# EAGLE design IMUinator2368 (EAGLE 6.2)
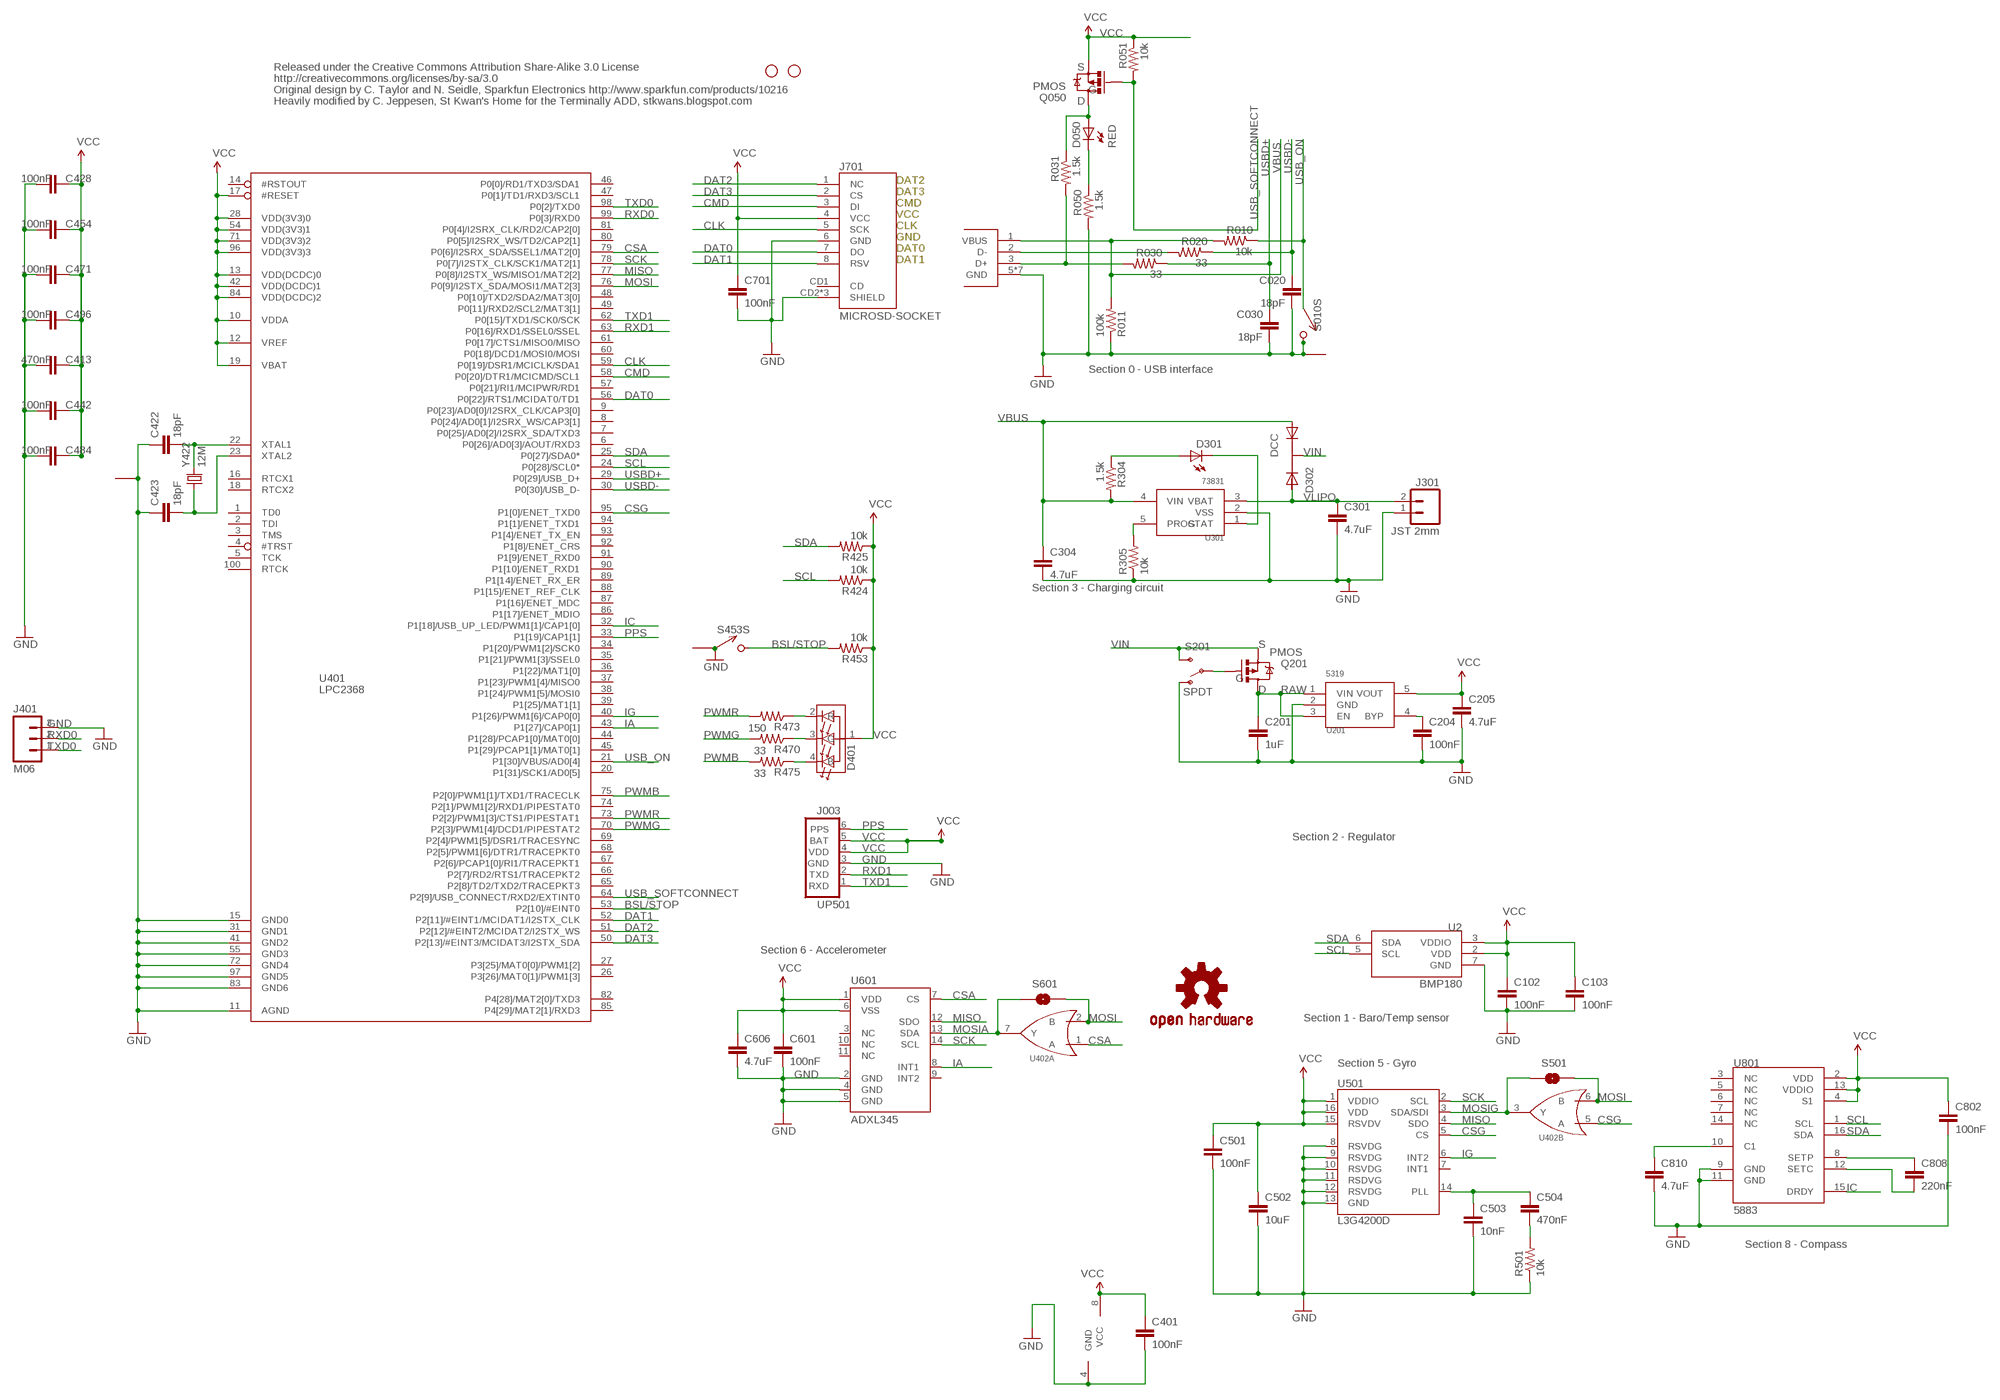
[diagram p0: schematic, sheet 1]

## Parts
C020  18pF  CAP0402-CAP  [0402-CAP]
C030  18pF  CAP0402-CAP  [0402-CAP]
C102  100nF  CAP0402-CAP  [0402-CAP]
C103  100nF  CAP0402-CAP  [0402-CAP]
C201  1uF  CAP0402-CAP  [0402-CAP]
C204  100nF  CAP0402-CAP  [0402-CAP]
C205  4.7uF  CAP0402-CAP  [0402-CAP]
C301  4.7uF  CAP0402-CAP  [0402-CAP]
C304  4.7uF  CAP0402-CAP  [0402-CAP]
C401  100nF  CAP0402-CAP  [0402-CAP]
C413  470nF  CAP0402-CAP  [0402-CAP]
C422  18pF  CAP0402-CAP  [0402-CAP]
C423  18pF  CAP0402-CAP  [0402-CAP]
C428  100nF  CAP0402-CAP  [0402-CAP]
C442  100nF  CAP0402-CAP  [0402-CAP]
C454  100nF  CAP0402-CAP  [0402-CAP]
C471  100nF  CAP0402-CAP  [0402-CAP]
C484  100nF  CAP0402-CAP  [0402-CAP]
C496  100nF  CAP0402-CAP  [0402-CAP]
C501  100nF  CAP0402-CAP  [0402-CAP]
C502  10uF  CAP0603-CAP  [0603-CAP]
C503  10nF  CAP0402-CAP  [0402-CAP]
C504  470nF  CAP0402-CAP  [0402-CAP]
C601  100nF  CAP0402-CAP  [0402-CAP]
C606  4.7uF  CAP0402-CAP  [0402-CAP]
C701  100nF  CAP0402-CAP  [0402-CAP]
C802  100nF  CAP0402-CAP  [0402-CAP]
C808  220nF  CAP0402-CAP  [0402-CAP]
C810  4.7uF  CAP0402-CAP  [0402-CAP]
D050  RED  LED0603  [LED-0603]
D301  RED  LED0603  [LED-0603]
D302  DCC  PMEG2005CT  [SOT-23-3]
D401  RGB  HSMF-C118  [HSMF-C118]
J001  USB_MICROB_JST  [UB-MC5BR3-SD204-4S]
J003  UP501  [UP501]
J301  JST 2mm  M02-JST-2MM-SMT  [JST-2-SMD]
J401  M06  M03PTH  [1X03]
J701  MICROSD-SOCKET  [MICROSD-SOCKET-PP]
JP1  STAND-OFF  [STAND-OFF]
JP2  STAND-OFF  [STAND-OFF]
Q050  PMOS  MOSFET-PCHANNELSMD  [SOT23-3]
Q201  PMOS  MOSFET-PCHANNELSMD  [SOT23-3]
R010  10k  RESISTOR0402-RES  [0402-RES]
R011  100k  RESISTOR0402-RES  [0402-RES]
R020  33  RESISTOR0402-RES  [0402-RES]
R030  33  RESISTOR0402-RES  [0402-RES]
R031  1.5k  RESISTOR0402-RES  [0402-RES]
R050  1.5k  RESISTOR0402-RES  [0402-RES]
R051  10k  RESISTOR0402-RES  [0402-RES]
R304  1.5k  RESISTOR0402-RES  [0402-RES]
R305  10k  RESISTOR0402-RES  [0402-RES]
R424  10k  RESISTOR0402-RES  [0402-RES]
R425  10k  RESISTOR0402-RES  [0402-RES]
R453  10k  RESISTOR0402-RES  [0402-RES]
R470  33  RESISTOR0402-RES  [0402-RES]
R473  150  RESISTOR0402-RES  [0402-RES]
R475  33  RESISTOR0402-RES  [0402-RES]
R501  10k  RESISTOR0402-RES  [0402-RES]
S010  SPST  B3U-1100P  [B3U-1100P]
S201  SPDT  SWITCH-SPSTSMD  [AYZ0202]
S453  SPST  B3U-1100P  [B3U-1100P]
S501  SOLDERJUMPERNO  [SJ_2S-NO]
S601  SOLDERJUMPERNO  [SJ_2S-NO]
U2  BMP180  [BMP180]
U201  5319  MIC5319D5  [SOT-23-5]
U301  73831  MCP73831  [SOT-23-5]
U401  LPC2368  [LQFP100]
U402  7432  SN74LVC2G32  [DCU_8]
U501  L3G4200D  [LGA16-4X4]
U601  ADXL345  [LGA14]
U801  5883  HMC5883LSMD  [16LPCC]
U$3  OSHW-LOGOS  [OSHW-LOGO-S]
Y422  12M  TSX-3225  [CRYSTAL_SMD]

## Nets
BSL/STOP: R453.2 S453.P$2 U401.53(P2[10]/#EINT0)
CLK: J701.5(SCK) U401.59(P0[19]/DSR1/MCICLK/SDA1)
CMD: J701.3(DI) U401.58(P0[20]/DTR1/MCICMD/SCL1)
CONN_D+: J001.3(D+) R030.2 R031.2
CONN_D-: J001.2(D-) R020.2
CSA: U401.79(P0[6]/I2SRX_SDA/SSEL1/MAT2[0]) U402.1(A:A) U601.7(CS)
CSG: U401.95(P1[0]/ENET_TXD0) U402.5(B:A) U501.5(CS)
DAT0: J701.7(DO) U401.56(P0[22]/RTS1/MCIDAT0/TD1)
DAT1: J701.8(RSV) U401.52(P2[11]/#EINT1/MCIDAT1/I2STX_CLK)
DAT2: J701.1(NC) U401.51(P2[12]/#EINT2/MCIDAT2/I2STX_WS)
DAT3: J701.2(CS) U401.50(P2[13]/#EINT3/MCIDAT3/I2STX_SDA)
DB: D401.4(B) R475.1
DG: D401.2(R) R473.1
DR: D401.3(G) R470.1
GND: C020.2 C030.2 C102.2 C103.2 C201.2 C204.2 C205.2 C301.2 C304.2 C401.2 C413.2 C422.1 C423.1 C428.2 C442.2 C454.2 C471.2 C484.2 C496.2 C501.2 C502.2 C503.2 C601.2 C606.2 C701.2 C802.2 C810.2 J001.5(GND) J001.P$6(GND) J001.P$7(GND) J001.P$8(GND) J001.P$9(GND) J001.P$10(GND) J001.P$11(GND) J003.3(GND) J301.1 J401.3 J701.6(GND) J701.CD2(SHIELD) J701.GND1(SHIELD) J701.GND3(SHIELD) R011.1 R050.2 R305.1 R501.1 S010.P$2 S010.P$3 S201.1(O) S453.P$1 S453.P$3 U2.7(GND) U201.2(GND) U301.2(VSS) U401.11(AGND) U401.15(GND0) U401.31(GND1) U401.41(GND2) U401.55(GND3) U401.72(GND4) U401.83(GND6) U401.97(GND5) U402.4(PWR:GND) U501.8(RSVDG) U501.9(RSVDG) U501.10(RSVDG) U501.11(RSDVG) U501.12(RSVDG) U501.13(GND) U601.2(GND) U601.4(GND) U601.5(GND) U801.9(GND) U801.11(GND) Y422.2 Y422.4
IA: U401.43(P1[27]/CAP0[1]) U601.8(INT1)
IC: U401.32(P1[18]/USB_UP_LED/PWM1[1]/CAP1[0]) U801.15(DRDY)
IG: U401.40(P1[26]/PWM1[6]/CAP0[0]) U501.6(INT2)
MISO: U401.77(P0[8]/I2STX_WS/MISO1/MAT2[2]) U501.4(SDO) U601.12(SDO)
MOSI: S501.2 S601.2 U401.76(P0[9]/I2STX_SDA/MOSI1/MAT2[3]) U402.2(A:B) U402.6(B:B)
MOSIA: S601.1 U402.7(A:Y) U601.13(SDA)
MOSIG: S501.1 U402.3(B:Y) U501.3(SDA/SDI)
N$1: D301.A R304.1
N$4: C503.1 C504.1 U501.14(PLL)
N$5: C504.2 R501.2
N$6: D050.A Q050.3(D) R031.1
N$7: D050.C R050.1
N$14: C808.1 U801.8(SETP)
N$15: C808.2 U801.12(SETC)
N$16: C810.1 U801.10(C1)
N$17: C204.1 U201.4(BYP)
PPS: J003.6(PPS) U401.33(P1[19]/CAP1[1])
PWMB: R475.2 U401.75(P2[0]/PWM1[1]/TXD1/TRACECLK)
PWMG: R470.2 U401.70(P2[3]/PWM1[4]/DCD1/PIPESTAT2)
PWMR: R473.2 U401.73(P2[2]/PWM1[3]/CTS1/PIPESTAT1)
PWR_SWITCH: Q201.1(G) S201.2(P)
RAW: C201.1 Q201.3(D) U201.1(VIN) U201.3(EN)
REG_PROG: R305.2 U301.5(PROG)
REG_STAT: D301.C U301.1(STAT)
RXD0: J401.2 U401.99(P0[3]/RXD0)
RXD1: J003.2(TXD) U401.63(P0[16]/RXD1/SSEL0/SSEL)
SCK: U401.78(P0[7]/I2STX_CLK/SCK1/MAT2[1]) U501.2(SCL) U601.14(SCL)
SCL: R424.2 U2.5(SCL) U401.24(P0[28]/SCL0*) U801.1(SCL)
SDA: R425.2 U2.6(SDA) U401.25(P0[27]/SDA0*) U801.16(SDA)
TXD0: J401.1 U401.98(P0[2]/TXD0)
TXD1: J003.1(RXD) U401.62(P0[15]/TXD1/SCK0/SCK)
USB_ON: R010.1 S010.P$1 U401.21(P1[30]/VBUS/AD0[4])
USB_SOFTCONNECT: Q050.1(G) R051.2 U401.64(P2[9]/USB_CONNECT/RXD2/EXTINT0)
USBD+: C030.1 R030.1 U401.29(P0[29]/USB_D+)
USBD-: C020.1 R020.1 U401.30(P0[30]/USB_D-)
VBUS [power]: C304.1 D302.1(A1) J001.1(VBUS) R010.2 R011.2 R304.2 U301.4(VIN)
VCC: C102.1 C103.1 C205.1 C401.1 C413.1 C428.1 C442.1 C454.1 C471.1 C484.1 C496.1 C501.1 C502.1 C601.1 C606.1 C701.1 C802.1 D401.1(A) J003.4(VDD) J003.5(BAT) J701.4(VCC) Q050.2(S) R051.1 R424.1 R425.1 R453.1 U2.2(VDD) U2.3(VDDIO) U201.5(VOUT) U401.10(VDDA) U401.12(VREF) U401.13(VDD(DCDC)0) U401.17(#RESET) U401.19(VBAT) U401.28(VDD(3V3)0) U401.42(VDD(DCDC)1) U401.54(VDD(3V3)1) U401.71(VDD(3V3)2) U401.84(VDD(DCDC)2) U401.96(VDD(3V3)3) U402.8(PWR:VCC) U501.1(VDDIO) U501.15(RSVDV) U501.16(VDD) U601.1(VDD) U601.6(VSS) U801.2(VDD) U801.4(S1) U801.13(VDDIO)
VIN: D302.3(K) Q201.2(S) S201.3(S)
VLIPO [power]: C301.1 D302.2(A2) J301.2 U301.3(VBAT)
XTAL1: C422.2 U401.22(XTAL1) Y422.3
XTAL2: C423.2 U401.23(XTAL2) Y422.1
Unconnected: J701.CD1(CD) U401.1(TD0) U401.2(TDI) U401.3(TMS) U401.4(#TRST) U401.5(TCK) U401.6(P0[26]/AD0[3]/AOUT/RXD3) U401.7(P0[25]/AD0[2]/I2SRX_SDA/TXD3) U401.8(P0[24]/AD0[1]/I2SRX_WS/CAP3[1]) U401.9(P0[23]/AD0[0]/I2SRX_CLK/CAP3[0]) U401.14(#RSTOUT) U401.16(RTCX1) U401.18(RTCX2) U401.20(P1[31]/SCK1/AD0[5]) U401.26(P3[26]/MAT0[1]/PWM1[3]) U401.27(P3[25]/MAT0[0]/PWM1[2]) U401.34(P1[20]/PWM1[2]/SCK0) U401.35(P1[21]/PWM1[3]/SSEL0) U401.36(P1[22]/MAT1[0]) U401.37(P1[23]/PWM1[4]/MISO0) U401.38(P1[24]/PWM1[5]/MOSI0) U401.39(P1[25]/MAT1[1]) U401.44(P1[28]/PCAP1[0]/MAT0[0]) U401.45(P1[29]/PCAP1[1]/MAT0[1]) U401.46(P0[0]/RD1/TXD3/SDA1) U401.47(P0[1]/TD1/RXD3/SCL1) U401.48(P0[10]/TXD2/SDA2/MAT3[0]) U401.49(P0[11]/RXD2/SCL2/MAT3[1]) U401.57(P0[21]/RI1/MCIPWR/RD1) U401.60(P0[18]/DCD1/MOSI0/MOSI) U401.61(P0[17]/CTS1/MISO0/MISO) U401.65(P2[8]/TD2/TXD2/TRACEPKT3) U401.66(P2[7]/RD2/RTS1/TRACEPKT2) U401.67(P2[6]/PCAP1[0]/RI1/TRACEPKT1) U401.68(P2[5]/PWM1[6]/DTR1/TRACEPKT0) U401.69(P2[4]/PWM1[5]/DSR1/TRACESYNC) U401.74(P2[1]/PWM1[2]/RXD1/PIPESTAT0) U401.80(P0[5]/I2SRX_WS/TD2/CAP2[1]) U401.81(P0[4]/I2SRX_CLK/RD2/CAP2[0]) U401.82(P4[28]/MAT2[0]/TXD3) U401.85(P4[29]/MAT2[1]/RXD3) U401.86(P1[17]/ENET_MDIO) U401.87(P1[16]/ENET_MDC) U401.88(P1[15]/ENET_REF_CLK) U401.89(P1[14]/ENET_RX_ER) U401.90(P1[10]/ENET_RXD1) U401.91(P1[9]/ENET_RXD0) U401.92(P1[8]/ENET_CRS) U401.93(P1[4]/ENET_TX_EN) U401.94(P1[1]/ENET_TXD1) U401.100(RTCK) U501.7(INT1) U601.3(NC) U601.9(INT2) U601.10(NC) U601.11(NC) U801.3(NC) U801.5(NC) U801.6(NC) U801.7(NC) U801.14(NC)

## Notes on the sheet
- Released under the Creative Commons Attribution Share-Alike 3.0 License | S
- http://creativecommons.org/licenses/by-sa/3.0
- Original design by C. Taylor and N. Seidle, Sparkfun Electronics http://www.sparkfun.com/products/10216 | G
- Heavily modified by C. Jeppesen, St Kwan's Home for the Terminally ADD, stkwans.blogspot.com | D
- DAT2
- DAT3
- CMD
- VCC
- CLK
- GND
- DAT0
- DAT1
- Section 0 - USB interface
- Section 3 - Charging circuit
- S
- G
- D
- Section 2 - Regulator
- Section 6 - Accelerometer
- Section 1 - Baro/Temp sensor
- Section 5 - Gyro
- Section 8 - Compass

## Library data of the parts
C020 C030 C422 C423 = SparkFun:CAP: Capacitor Standard 0603 ceramic capacitor, and 0.1" leaded capacitor.; DIGIKEY: 445-1238-1-ND
C102 C103 C204 C401 C428 C442 C454 C471 C484 C496 C501 C601 C701 C802 = SparkFun:CAP: Capacitor Standard 0603 ceramic capacitor, and 0.1" leaded capacitor.; DIGIKEY: 445-1268-1-ND
C201 = SparkFun:CAP: Capacitor Standard 0603 ceramic capacitor, and 0.1" leaded capacitor.; DIGIKEY: 445-1415-1-ND
C205 C301 C304 C606 C810 = SparkFun:CAP: Capacitor Standard 0603 ceramic capacitor, and 0.1" leaded capacitor.; DIGIKEY: 445-7395-1-ND
C413 C504 = SparkFun:CAP: Capacitor Standard 0603 ceramic capacitor, and 0.1" leaded capacitor.; DIGIKEY: 445-4976-1-ND
C502 = SparkFun-Passives:CAP: Capacitor Standard 0603 ceramic capacitor, and 0.1" leaded capacitor.; DIGIKEY: 445-7486-1-ND
C503 = SparkFun:CAP: Capacitor Standard 0603 ceramic capacitor, and 0.1" leaded capacitor.; DIGIKEY: 445-4943-1-ND
C808 = SparkFun:CAP: Capacitor Standard 0603 ceramic capacitor, and 0.1" leaded capacitor.; DIGIKEY: 445-4972-1-ND
D050 D301 = SparkFun:LED: LEDs Standard schematic elements and footprints for 5mm, 3mm, 1206, and 0603 sized LEDs. 5mm - Spark Fun Electronics SKU : COM-00529 (and others); DIGIKEY: 350-2029-1-ND
D302 = KwanSystems:PMEG2005CT; DIGIKEY: 568-6500-1-ND
D401 = KwanSystems:HSMF-C118; DIGIKEY: 516-1778-1-ND
J001 = KwanSystems:USB_MICROB_JST; DIGIKEY: 455-2562-1-ND
J003 = KwanSystems:UP501; DIGIKEY: $NOPART
J301 = SparkFun:M02: Header 2 Standard 2-pin 0.1" header. Use with straight break away headers (SKU : PRT-00116), right angle break away headers (PRT-00553), swiss pins (PRT-00743), machine pins (PRT-00117), and female headers (PRT-00115). Molex polarized connector foot print use with SKU : PRT-08233 with associated crimp pins and housings.; DIGIKEY: 455-1749-1-ND
J401 = SparkFun-Connectors:M03: Header 3 Standard 3-pin 0.1" header. Use with straight break away headers (SKU : PRT-00116), right angle break away headers (PRT-00553), swiss pins (PRT-00743), machine pins (PRT-00117), and female headers (PRT-00115). Molex polarized connector foot print use with SKU : PRT-08232 with associated crimp pins and housings.; DIGIKEY: $NOPART
J701 = KwanSystems:MICROSD-SOCKET: microSD Socket Push-push type uSD socket. Digikey 101-00660-68-6-1-ND. tDoc lines correctly indicate media card edge positions when inserting (unlocked, locked, depressed).; DIGIKEY: 101-00581-59-1-ND
JP1 JP2 = SparkFun:STAND-OFF: Stand Off This is the mechanical footprint for a #4 phillips button head screw. Use the keepout ring to avoid running the screw head into surrounding components. SKU : PRT-00447; DIGIKEY: $NOPART
Q050 Q201 = SparkFun:MOSFET-PCHANNEL; DIGIKEY: NTR1P02T1GOSCT-ND
R010 R051 R305 = SparkFun:RESISTOR: Resistor Basic schematic elements and footprints for 0603, 1206, and PTH resistors.; DIGIKEY: P10.0KLCT-ND
R011 = SparkFun:RESISTOR: Resistor Basic schematic elements and footprints for 0603, 1206, and PTH resistors.; DIGIKEY: P100KLCT-ND
R020 R030 R473 R475 = SparkFun:RESISTOR: Resistor Basic schematic elements and footprints for 0603, 1206, and PTH resistors.; DIGIKEY: P33.0LCT-ND
R031 R050 R304 = SparkFun:RESISTOR: Resistor Basic schematic elements and footprints for 0603, 1206, and PTH resistors.; DIGIKEY: P1.50KLCT-ND
R424 R425 R453 R501 = SparkFun-Passives:RESISTOR: Resistor Basic schematic elements and footprints for 0603, 1206, and PTH resistors.; DIGIKEY: P10.0KLCT-ND
R470 = SparkFun:RESISTOR: Resistor Basic schematic elements and footprints for 0603, 1206, and PTH resistors.; DIGIKEY: P150LCT-ND
S010 S453 = KwanSystems:B3U-1100P; DIGIKEY: SW1021CT-ND
S201 = SparkFun:SWITCH-SPST: SPST Switch Simple slide switch. Spark Fun Electronics SKU : COM-00102; DIGIKEY: 401-2013-1-ND
S501 S601 = SparkFun:SOLDERJUMPER: Solder Jumper Standard SMD solder jumper. Used to automate production. Two varients : Normally Open and Normally Closed are the same, but have different paste layers. NC will have a large amount of paste and should jumper during reflow.; DIGIKEY: $NOPART
U2 = KwanSystems:BMP180; DIGIKEY: 828-1027-1-ND
U201 = KwanSystems:MIC5319; DIGIKEY: 576-1910-1-ND
U301 = KwanSystems:MCP73831; DIGIKEY: MCP73831T-2ACI/OTCT-ND
U401 = KwanSystems:LPC2368; DIGIKEY: 568-3997-ND
U402 = KwanSystems:SN74LVC2G32; DIGIKEY: 296-13268-1-ND
U501 = SparkFun:L3G4200D: L3G4200D Three-axis, digital output gyroscope The L3G4200D is a low-power three-axis angular rate sensor, has a full scale of ±250/±500/±2000 dps and is capable of measuring rates with a user-selectable bandwidth. It includes a sensing element and an IC interface capable of providing the measured angular rate to the external world through a digital interface (I2C/SPI). Package: 4x4x1.1 LGA-16 (LGA16-4x4.PAC); DIGIKEY: 497-11071-1-ND
U601 = SparkFun:ADXL345; DIGIKEY: ADXL345BCCZ-RL7CT-ND
U801 = SparkFun:HMC5883L: 3 Axis Digital Compass IC; DIGIKEY: 342-1082-1-ND
U$3 = SparkFun:OSHW-LOGO: Open Source Hardware Logo This logo indicates the piece of hardware it is found on incorporates a OSHW license and/or adheres to the definition of open source hardware found here: http://freedomdefined.org/OSHW; DIGIKEY: $NOPART
Y422 = KwanSystems:TSX-3225; DIGIKEY: 887-1316-1-ND

## Net classes
0 default: width 0.152 mm, drill 0.33 mm, clearance 0.152 mm
1 power: width 0.152 mm, drill 0.33 mm, clearance 0.152 mm to class 0, clearance 0.152 mm
2 hv: width 0.152 mm, drill 0.33 mm, clearance 0.152 mm to class 0, clearance 0.152 mm to class 1, clearance 0.152 mm

## Board
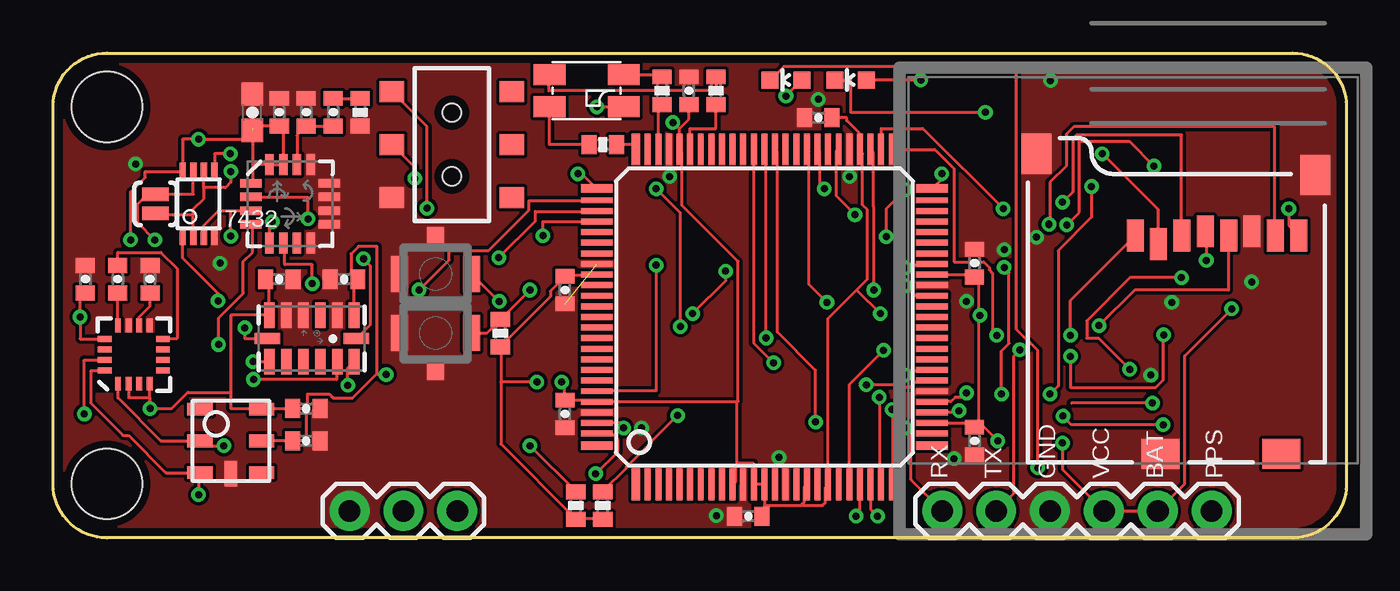
[diagram p1: board, top side]
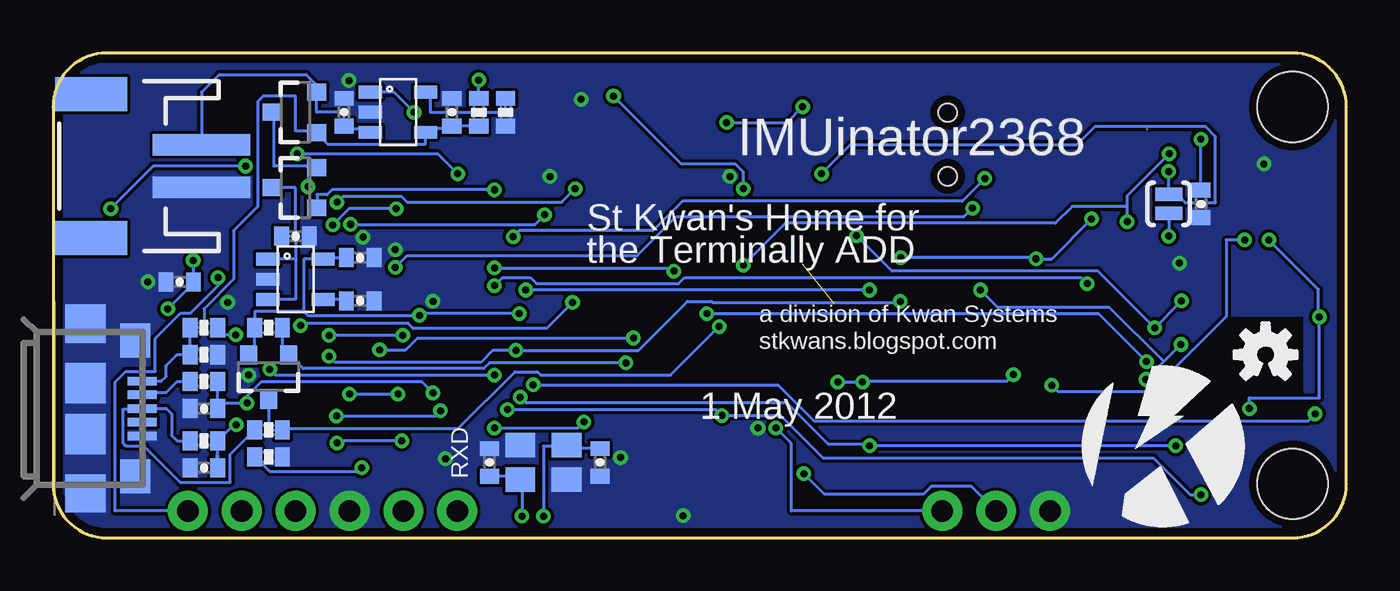
[diagram p2: board, bottom side, seen from below]

Size 60.96 x 22.86 mm. Coordinates in mm from the lower left corner, seen from the top.
Outline: 2.54,22.86 58.42,22.86 arc-90 60.96,20.32 60.96,2.54 arc-90 58.42,0 2.54,0 arc-90 0,2.54 0,20.32 arc-90 2.54,22.86
Copper layers (1*16): Top 0.0356mm / dielectric 1.5011mm / Bottom 0.0356mm
Design rules: minimum track width 6mil, minimum drill 13mil, track to track 6mil, track to pad 6mil, pad to pad 6mil, via to via 6mil, smd to smd 6mil, copper to edge 15mil, drill to drill 6mil, minimum pad ring 7mil, minimum via ring 7mil, stop-mask expansion 4mil, vias tented up to drill 14mil, thermal gap 10mil
tRestrict: area 2,9.7 to 2.8,10.4; area 4.8,9.7 to 5.6,10.4; area 2.8,7.6 to 4.8,9.7; area 4.8,6.9 to 5.6,7.6; area 2,6.9 to 2.8,7.6
bRestrict: area 2,6.9 to 5.6,10.4

### Footprints (pad centres in the part's own frame; a part is rotated, then mirrored left to right if it is on the bottom)
0402-CAP = smd 0.7 x 0.9: 1 -0.65,0; 2 0.65,0
0603-CAP = smd 1.1 x 1: 1 -0.85,0; 2 0.85,0
LED-0603 = smd 0.8 x 0.8: A 0,-0.75; C 0,0.75
SOT-23-3 = smd 0.9 x 0.8: 1 -1,0.95; 2 -1,-0.95; 3 1.1,0
HSMF-C118 = smd 1.5 x 1: 1 1.75,-0.75; 2 1.75,0.75; 3 -1.75,0.75; 4 -1.75,-0.75
UB-MC5BR3-SD204-4S = smd 0.4 x 1.35: 1 -1.3,2.675; 2 -0.65,2.675; 3 0,2.675; 4 0.65,2.675; 5 1.3,2.675 | smd 1.8 x 1.9: P$6 4,0; P$7 -4,0 | smd 1.9 x 1.9: P$8 -1.2,0; P$9 1.2,0 | smd 1.6 x 1.4: P$10 -3.2,2.35; P$11 3.2,2.35
UP501 = drill 1.016 pad 1.88: 1 0,0; 2 2.54,0; 3 5.08,0; 4 7.62,0; 5 10.16,0; 6 12.7,0
JST-2-SMD = smd 1 x 4.6: 1 -1,-3.7; 2 1,-3.7 | smd 1.6 x 3.4: NC1 -3.4,1.5; NC2 3.4,1.5
1X03 = drill 1.016 pad 1.88: 1 0,0; 2 2.54,0; 3 5.08,0
MICROSD-SOCKET-PP = smd 0.8 x 1.5: 1 -8.94,10.7; 2 -7.84,10.3; 3 -6.74,10.7; 4 -5.64,10.9; 5 -4.54,10.7; 6 -3.44,10.9; 7 -2.34,10.7; 8 -1.24,10.7 | smd 1.8 x 1.4: CD1 -2.05,0.4; CD2 -7.75,0.4 | smd 1.4 x 1.9: GND1 -13.6,14.55; GND3 -0.45,13.55
STAND-OFF = hole 3.302: 0,0
SOT23-3 = smd 0.8 x 0.9: 1 -0.95,-1; 2 0.95,-1; 3 0,1.1
0402-RES = smd 0.7 x 0.9: 1 -0.65,0; 2 0.65,0
B3U-1100P = smd 0.8 x 1.7: P$1 -1.7,0; P$2 1.7,0 | smd 0.8 x 1.1: P$3 0,-1.65
AYZ0202 = smd 1 x 1.15: 1 -2.5,2.825; 2 0,2.825; 3 2.5,2.825; 4 -2.5,-2.825; 5 0,-2.825; 6 2.5,-2.825 | hole 0.85: 1.5,0; -1.5,0
SJ_2S-NO = smd 0.635 x 1.27: 1 -0.45,0; 2 0.45,0
BMP180 = smd 0.6 x 1.2: 1 1.5,1.45; 2 0,1.45; 3 -1.5,1.45; 4 -1.5,-1.45; 5 0,-1.45; 6 1.5,-1.45 | smd 1.2 x 0.6: 7 1.55,0
SOT-23-5 = smd 0.6 x 1.1: 1 -0.95,-1.3; 2 0,-1.3; 3 0.95,-1.3; 4 0.95,1.3; 5 -0.95,1.3
LQFP100 = smd 1.5 x 0.4: 1 -7.9,6.06; 25 -7.9,-6.06; 51 7.9,-6.06; 75 7.9,6.06 | smd 1.5 x 0.28: 2 -7.9,5.5; 3 -7.9,5; 4 -7.9,4.5; 5 -7.9,4; 6 -7.9,3.5; 7 -7.9,3; 8 -7.9,2.5; 9 -7.9,2; 10 -7.9,1.5; 11 -7.9,1; 12 -7.9,0.5; 13 -7.9,0; 14 -7.9,-0.5; 15 -7.9,-1; 16 -7.9,-1.5; 17 -7.9,-2; 18 -7.9,-2.5; 19 -7.9,-3; 20 -7.9,-3.5; 21 -7.9,-4; 22 -7.9,-4.5; 23 -7.9,-5; 24 -7.9,-5.5; 52 7.9,-5.5; 53 7.9,-5; 54 7.9,-4.5; 55 7.9,-4; 56 7.9,-3.5; 57 7.9,-3; 58 7.9,-2.5; 59 7.9,-2; 60 7.9,-1.5; 61 7.9,-1; 62 7.9,-0.5; 63 7.9,0; 64 7.9,0.5; 65 7.9,1; 66 7.9,1.5; 67 7.9,2; 68 7.9,2.5; 69 7.9,3; 70 7.9,3.5; 71 7.9,4; 72 7.9,4.5; 73 7.9,5; 74 7.9,5.5 | smd 0.4 x 1.5: 26 -6.06,-7.9; 50 6.06,-7.9; 76 6.06,7.9; 100 -6.06,7.9 | smd 0.28 x 1.5: 27 -5.5,-7.9; 28 -5,-7.9; 29 -4.5,-7.9; 30 -4,-7.9; 31 -3.5,-7.9; 32 -3,-7.9; 33 -2.5,-7.9; 34 -2,-7.9; 35 -1.5,-7.9; 36 -1,-7.9; 37 -0.5,-7.9; 38 0,-7.9; 39 0.5,-7.9; 40 1,-7.9; 41 1.5,-7.9; 42 2,-7.9; 43 2.5,-7.9; 44 3,-7.9; 45 3.5,-7.9; 46 4,-7.9; 47 4.5,-7.9; 48 5,-7.9; 49 5.5,-7.9; 77 5.5,7.9; 78 5,7.9; 79 4.5,7.9; 80 4,7.9; 81 3.5,7.9; 82 3,7.9; 83 2.5,7.9; 84 2,7.9; 85 1.5,7.9; 86 1,7.9; 87 0.5,7.9; 88 0,7.9; 89 -0.5,7.9; 90 -1,7.9; 91 -1.5,7.9; 92 -2,7.9; 93 -2.5,7.9; 94 -3,7.9; 95 -3.5,7.9; 96 -4,7.9; 97 -4.5,7.9; 98 -5,7.9; 99 -5.5,7.9
DCU_8 = smd 0.3 x 0.8: 1 -0.75,-1.55; 2 -0.25,-1.55; 3 0.25,-1.55; 4 0.75,-1.55; 5 0.75,1.55; 6 0.25,1.55; 7 -0.25,1.55; 8 -0.75,1.55
LGA16-4X4 = smd 1 x 0.4: 1 -1.85,0.975; 2 -1.85,0.325; 3 -1.85,-0.325; 4 -1.85,-0.975; 9 1.85,-0.975; 10 1.85,-0.325; 11 1.85,0.325; 12 1.85,0.975 | smd 0.4 x 1: 5 -0.975,-1.85; 6 -0.325,-1.85; 7 0.325,-1.85; 8 0.975,-1.85; 13 0.975,1.85; 14 0.325,1.85; 15 -0.325,1.85; 16 -0.975,1.85
LGA14 = smd 0.5 x 1.2: 1 2,1.1; 2 1.2,1.1; 3 0.4,1.1; 4 -0.4,1.1; 5 -1.2,1.1; 6 -2,1.1; 8 -2,-1.1; 9 -1.2,-1.1; 10 -0.4,-1.1; 11 0.4,-1.1; 12 1.2,-1.1; 13 2,-1.1 | smd 1.2 x 0.5: 7 -2.1,0; 14 2.1,0
16LPCC = smd 0.65 x 0.28: 1 -1.37,0.75; 2 -1.37,0.25; 3 -1.37,-0.25; 4 -1.37,-0.75; 9 1.37,-0.75; 10 1.37,-0.25; 11 1.37,0.25; 12 1.37,0.75 | smd 0.28 x 0.65: 5 -0.75,-1.37; 6 -0.25,-1.37; 7 0.25,-1.37; 8 0.75,-1.37; 13 0.75,1.37; 14 0.25,1.37; 15 -0.25,1.37; 16 -0.75,1.37
CRYSTAL_SMD = smd 1.4 x 1.15: 1 -1.092,-0.813; 2 1.092,-0.813; 3 1.092,0.813; 4 -1.092,0.813

### Placement (x,y rotation side)
C020  53.85,6.1 180 bottom
C030  53.85,3.3 180 bottom
C102  11.94,4.57 0 top
C103  11.94,6.1 0 top
C201  49.53,14.22 0 bottom
C204  46.48,11.18 0 bottom
C205  46.48,13.21 0 bottom
C301  47.24,20.07 90 bottom
C304  42.16,20.07 90 bottom
C401  6.86,15.75 270 bottom
C413  32.77,1.02 180 top
C422  35.18,3.56 90 bottom
C423  40.39,3.56 270 bottom
C428  43.43,4.57 270 top
C442  43.43,12.95 90 top
C454  36.07,19.81 180 top
C471  29.97,21.08 90 top
C484  24.13,11.68 270 top
C496  24.13,5.84 270 top
C501  10.67,20.07 90 top
C502  9.4,20.07 90 top
C503  11.94,20.07 90 top
C504  13.21,20.07 90 top
C601  13.72,12.19 180 top
C606  10.67,12.19 0 top
C701  54.99,12.06 180 bottom
C802  1.52,12.19 90 top
C808  3.05,12.19 270 top
C810  4.57,12.19 90 top
D050  34.54,21.59 90 top
D301  37.59,21.59 90 top
D302  49.53,20.07 180 bottom
D401  25.15,21.08 0 top
J001  59.44,6.1 270 bottom
J003  41.91,1.27 0 top
J301  57.66,17.53 90 bottom
J401  19.05,1.27 180 top
J701  59.94,3.56 0 top
JP1  2.54,2.54 0 top
JP2  2.54,20.32 0 top
Q050  50.8,7.62 180 bottom
Q201  49.53,16.51 90 bottom
R010  53.85,9.91 180 bottom
R011  53.85,8.64 180 bottom
R020  53.85,7.37 180 bottom
R030  53.85,4.57 180 bottom
R031  50.8,5.08 180 bottom
R050  50.8,3.81 0 bottom
R051  50.8,9.91 0 bottom
R304  40.89,20.07 270 bottom
R305  39.62,20.07 90 bottom
R424  24.64,1.52 90 top
R425  25.91,1.52 90 top
R453  21.08,9.65 90 top
R470  31.24,21.08 270 top
R473  28.7,21.08 270 top
R475  25.91,18.54 0 top
R501  14.48,20.07 90 top
S010  18.03,12.45 180 top
S201  18.8,18.54 90 top
S453  18.03,9.65 0 top
S501  8.38,15.75 90 bottom
S601  4.83,15.75 270 top
U2  8.38,4.57 270 top
U201  49.53,12.19 270 bottom
U301  44.7,20.07 270 bottom
U401  33.53,10.41 90 top
U402  6.86,15.75 0 top
U501  11.18,15.75 0 top
U601  12.19,9.4 0 top
U801  3.81,8.64 90 top
U$1  [KWAN_CIRCLE]  8.64,4.32 0 bottom
U$3  3.81,8.64 0 bottom
Y422  37.85,3.56 0 bottom

### Tracks (layer width: path | path; a pad name or v marks a point on that pad's centre or on a via)
BSL/STOP  (via drill 0.33)
  Top 0.152: S453.P$2 20.45,9.65 21.08,10.29 R453.2 21.13,10.34 v22.48,11.68 | v38.68,11.68 38.68,15.6 38.66,15.62 38.66,18.19 U401.53
  Bottom 0.152: v22.48,11.68 v38.68,11.68
CLK  (via drill 0.33)
  Top 0.152: v36.47,11.1 35.64,11.94 35.64,18.21 U401.59 | v49.3,10.01 50.98,11.68 55.4,11.68 J701.5
  Bottom 0.152: v36.47,11.1 37.67,9.91 44.02,9.91 44.25,10.13 49.17,10.13 v49.3,10.01
CMD  (via drill 0.33)
  Top 0.152: v36.35,16.46 36.14,16.66 36.14,18.21 36.04,18.31 U401.58 | v47.57,15.82 48.06,16.31 48.06,18.82 48.23,19 53.19,19 53.19,14.28 J701.3
  Bottom 0.152: v36.35,16.46 36.98,15.82 44.27,15.82 44.55,16.1 47.3,16.1 v47.57,15.82
CONN_D+
  Bottom 0.152: R030.2 55.12,4.57 55.37,4.83 55.37,5.84 55.63,6.1 J001.3 56.79,6.04 57.68,6.04 57.68,4.5 57.53,4.34 56.69,4.34 54.97,2.62 52.6,2.62 52.6,3.94 R031.2
CONN_D-
  Bottom 0.152: J001.2 56.65,6.86 55.63,6.86 55.12,7.37 R020.2
CSA  (via drill 0.33)
  Top 0.152: 6.12,14.1 U402.1 6.1,14.09 6.1,13.21 7.77,11.53 v7.77,11.18 | U601.7 9.04,9.4 v9.04,9.91 | v23.09,14.25 23.09,14.91 25.6,14.91 U401.79
  Bottom 0.152: v7.77,11.18 v9.04,9.91 11.71,12.57 21.41,12.57 v23.09,14.25
CSG  (via drill 0.33)
  Top 0.152: v10.34,14.91 10.21,14.78 10.21,13.92 U501.5 | 7.62,17.32 U402.5 7.61,18.11 v8.36,18.11 | v28.42,12.85 28.42,6.93 25.63,6.93 U401.95
  Bottom 0.152: v8.36,18.11 10.34,16.13 10.34,15.62 | v10.34,14.91 10.34,15.62 | v28.42,12.85 26.44,14.83 13.72,14.83 12.93,15.62 10.34,15.62
DAT0  (via drill 0.33)
  Top 0.152: v37.8,15.24 36.93,16.1 36.93,18.24 37.01,18.31 U401.56 | v46.94,14.78 46.99,14.83 46.99,16.76 47.75,17.53 47.75,19.02 48.11,19.38 57.58,19.38 57.58,14.28 J701.7
  Bottom 0.152: v37.8,15.24 38.25,14.78 v46.94,14.78
DAT1  (via drill 0.33)
  Top 0.152: v58.24,15.52 58.24,14.73 58.7,14.28 J701.8 | v51.89,17.53 50.72,18.69 48.36,18.69 48.36,15.34 v47.78,14.76 | v44.78,15.52 41,19.3 39.04,19.3 39.04,18.34 U401.52
  Bottom 0.152: v58.24,15.52 56.24,17.53 v51.89,17.53 | v47.78,14.76 47.02,15.52 v44.78,15.52
DAT2  (via drill 0.33)
  Top 0.152: v47.95,9.55 47.95,11.2 J701.1 | v44.48,9.55 44.27,9.75 44.27,12.5 44.12,12.65 44.12,12.75 43.87,13.01 42.47,13.01 42.47,17.4 41.55,18.31 U401.51
  Bottom 0.152: v44.48,9.55 v47.95,9.55
DAT3  (via drill 0.33)
  Top 0.152: v41.88,17.17 41.88,16.92 41.45,16.48 U401.50 | v49.45,18.11 52.09,15.47 J701.2
  Bottom 0.152: v41.88,17.17 42.82,18.11 v49.45,18.11
DB
  Top 0.152: R475.1 23.4,18.54 D401.4
DG
  Top 0.152: D401.2 28.7,21.83 R473.1
DR
  Top 0.152: R470.1 31.24,21.08 23.37,21.08 23.37,21.84 23.39,21.84 D401.3
GND  (via drill 0.33)  (1 unrouted)
  other vias: 7.87,12.95 3.89,17.63 42.47,3.73 34.21,3.78 31.27,1.04 27.74,5.18 52.73,11.1 51.74,7.67 56.49,12.06 37.54,17.04 36.07,20.68 44.83,13.59 43.05,11.15 46.35,14.17 47.02,21.56 29.06,17.04
  pour Bottom (no thermals): 2.54,22.86 58.42,22.86 arc-90 60.96,20.32 60.96,2.54 arc-90 58.42,0 2.54,0 arc-90 0,2.54 0,20.32 arc-90
  pour Top (no thermals): 2.54,22.86 58.42,22.86 arc-90 60.96,20.32 60.96,2.54 arc-90 58.42,0 2.54,0 arc-90 0,2.54 0,20.32 arc-90
IA  (via drill 0.33)
  Top 0.152: v9.42,8.31 U601.8 | v30.15,10.57 31.7,12.12 v31.7,12.57 | v40.16,12.72 40.51,12.72 40.69,12.9 U401.43
  Bottom 0.152: v9.42,8.31 11.68,10.57 v30.15,10.57 | v31.7,12.57 31.85,12.72 v40.16,12.72
IC  (via drill 0.33)
  Top 0.152: v1.47,5.84 1.47,8.38 U801.15 | v38.33,7.21 39.8,7.21 39.93,7.09 40.44,7.09 40.44,7.14 40.69,7.39 41.43,7.39 U401.32
  Bottom 0.152: v1.47,5.84 1.8,5.51 25.09,5.51 26.8,7.21 v38.33,7.21
IG  (via drill 0.33)
  Top 0.152: v12.22,11.99 12.22,12.88 10.92,12.88 10.92,13.9 | v40.16,11.89 40.62,11.43 41.43,11.43 U401.40 | 10.87,13.89 U501.6 10.92,13.9 | 10.92,13.9 10.92,13.97
  Bottom 0.152: v12.22,11.99 12.5,12.27 31.19,12.27 31.47,11.99 38.18,11.99 38.46,12.27 39.78,12.27 v40.16,11.89
MISO  (via drill 0.33)
  Top 0.152: v7.8,9.12 7.8,10.36 8.97,11.53 8.97,13.03 9.4,13.46 9.4,14.73 9.37,14.73 U501.4 9.32,14.76 | v9.45,7.47 13.36,7.47 13.36,8.26 13.39,8.28 U601.12 | v17.25,11.68 18.67,13.11 18.67,13.54 20.52,13.54 22.43,15.44 22.43,15.9 25.6,15.9 U401.77
  Bottom 0.152: v9.45,7.47 8.61,8.31 | 8.61,8.31 v7.8,9.12 | v17.25,11.68 16.43,10.87 11.18,10.87 8.61,8.31
MOSI  (via drill 0.33)
  Top 0.152: v8.38,17.27 8.38,16.76 8.13,16.51 7.11,16.51 | 7.11,16.51 U402.6 | U402.2 6.61,15.24 | 6.61,15.24 6.61,15.5 7.11,16 7.11,16.51 | S601.2 4.88,15.24 6.61,15.24 | v24.74,17.17 24.92,17.17 25.6,16.48 U401.76
  Bottom 0.152: v8.38,17.27 S501.2 8.33,16.15 7.95,16.15 7.59,15.8 6.17,15.8 6.17,18.92 6.63,19.38 11.86,19.38 12.7,18.54 23.37,18.54 v24.74,17.17
MOSIA  (via drill 0.33)
  Top 0.152: U402.7 6.61,16.2 S601.1 4.78,16.15 4.39,16.15 3.96,15.72 3.96,14.88 v4.8,14.05 | v13.89,7.19 13.89,8 14.17,8.28 U601.13
  Bottom 0.152: v13.89,7.19 13.59,6.88 9.22,6.88 5.66,10.44 5.66,14.05 v4.8,14.05
MOSIG  (via drill 0.33)
  Top 0.152: v8.38,14.22 8.38,15.42 U501.3 7.8,15.42 7.11,14.73 U402.3
  Bottom 0.152: S501.1 v8.38,14.22
N$1  (via drill 0.33)
  Top 0.152: v40.89,21.59 D301.A
  Bottom 0.152: R304.1 v40.89,21.59
N$4
  Top 0.152: C504.1 C503.1 11.5,18.98 U501.14
N$5
  Top 0.152: C504.2 R501.2
N$6  (via drill 0.33)
  Top 0.152: v34.54,20.83 34.54,20.85 D050.A | v28.42,16.46 29.57,15.32 v29.57,9.96
  Bottom 0.152: Q050.3 50.8,5.08 R031.1 50.09,5.11 50.04,5.16 41.86,5.16 39.19,7.82 38.12,7.82 37.97,7.67 31.85,7.67 v29.57,9.96 | v34.54,20.83 31.34,17.63 28.8,17.63 28.42,17.25 v28.42,16.46
N$7  (via drill 0.33)
  Top 0.152: v46.41,3.3 46.41,8.84 45.41,9.83 45.41,22.23 34.44,22.23 33.81,21.59 D050.C
  Bottom 0.152: v46.41,3.3 46.58,3.12 50.75,3.12 51.44,3.81 R050.1
N$14
  Top 0.152: C808.1 3.05,13.46 5.08,13.46 5.84,12.7 5.84,9.4 5.83,9.39 U801.8
N$15
  Top 0.152: U801.12 3.05,10.01 C808.2
N$16
  Top 0.152: U801.10 4.06,10.41 4.57,10.92 C810.1
N$17
  Bottom 0.152: C204.1 47.13,11.24 U201.4
PPS  (via drill 0.33)
  Top 0.152: v40.16,7.67 40.16,7.9 U401.33 | v50.75,7.95 49.28,9.42 48.72,9.42 48.72,10.24 50.75,12.27 v53.19,12.27
  Bottom 0.152: v40.16,7.67 50.47,7.67 v50.75,7.95 | v53.19,12.27 53.19,11.89 54.48,10.59 54.94,10.59 56.13,9.4 56.13,7.85 57.53,7.85 58.04,7.34 58.04,1.27 J003.6
PWMB
  Top 0.152: U401.75 27.47,18.54 R475.2
PWMG
  Top 0.152: U401.70 30.03,19.3 31.24,19.3 R470.2
PWMR
  Top 0.152: U401.73 28.53,20.32 28.7,20.32 R473.2
PWR_SWITCH  (via drill 0.33)
  Top 0.152: v40.16,16.41 39.27,15.52 v39.27,14.2 | S201.2 17.04,17.48 v17.04,16.94
  Bottom 0.152: v40.16,16.41 47.8,16.41 48.03,16.18 48.51,16.18 48.51,15.57 Q201.1 | v39.27,14.2 38.99,14.48 32.69,14.48 31.29,15.88 18.11,15.88 v17.04,16.94
RAW
  Bottom 0.152: C201.1 49.53,14.22 | 49.53,14.22 49.53,16.51 Q201.3 | 49.53,14.22 49.53,13.14 | 49.53,13.14 U201.1 | 49.53,13.14 49.53,11.24 U201.3
REG_PROG
  Bottom 0.152: U301.5 43.18,20.79 43.18,20.07 39.62,20.07 R305.2
REG_STAT  (via drill 0.33)
  Top 0.152: D301.C 37.59,21.59 37.59,20.07 v43.94,20.07
  Bottom 0.152: v43.94,20.07 44.89,21.02 U301.1
RXD0  (via drill 0.33)
  Top 0.152: v25.58,3.02 26.62,4.06 26.62,4.65 26.36,4.9 U401.99
  Bottom 0.152: v25.58,3.02 24.61,2.06 19.94,2.06 19.56,2.44 17.68,2.44 J401.2
RXD1  (via drill 0.33)
  Top 0.152: v33.6,9.42 33.6,18.24 U401.63 | v45.57,8.87 45.29,8.59 45.29,2.11 J003.2
  Bottom 0.152: v33.6,9.42 43.79,9.42 44.35,8.87 v45.57,8.87
SCK  (via drill 0.33)
  Top 0.152: v12.01,15.04 12.01,16.05 9.35,16.05 U501.2 | v14.63,13.16 14.96,12.83 14.96,10.06 U601.14 | v21.01,13.21 22.73,14.94 22.73,15.39 25.6,15.39 U401.78
  Bottom 0.152: v12.01,15.04 13.89,13.16 v14.63,13.16 14.68,13.21 v21.01,13.21
SCL  (via drill 0.33)
  Top 0.152: 3.06,7.35 U801.1 3.06,6.59 5.08,4.57 U2.5 6.99,4.52 6.99,4.34 v8.05,4.34 | v22.48,4.34 24.64,2.18 R424.2 | v38.94,6.63 38.94,2.59 39.01,2.52 U401.24
  Bottom 0.152: v8.05,4.34 v22.48,4.34 22.53,4.39 24.41,4.39 26.36,6.35 38.66,6.35 v38.94,6.63
SDA  (via drill 0.33)
  Top 0.152: U801.16 2.44,7.87 1.78,7.87 1.78,6.35 3.3,4.83 3.56,4.83 5.31,3.07 U2.6 6.96,3.05 6.86,2.95 v6.86,2.03 | v29.44,5.77 27.03,3.35 27.03,3.3 25.91,2.18 R425.2 | v39.55,6.04 39.57,6.02 39.57,2.52 U401.25
  Bottom 0.152: v39.55,6.04 29.72,6.04 v29.44,5.77 26.67,5.77 24.66,3.76 9.09,3.76 7.37,2.03 v6.86,2.03
TXD0  (via drill 0.33)
  Top 0.152: v26.9,5.18 26.9,5.41 U401.98
  Bottom 0.152: v26.9,5.18 26.16,4.45 26.16,1.27 J401.1
TXD1  (via drill 0.33)
  Top 0.152: v35.94,5.46 35.94,7.9 34.14,9.7 34.14,18.21 U401.62 | v40.16,5.18 40.44,4.9 40.44,2.74 J003.1
  Bottom 0.152: v35.94,5.46 36.22,5.18 v40.16,5.18
USB_ON  (via drill 0.33)
  Top 0.152: v52.35,9.58 52.32,9.55 52.32,7.44 51.97,7.09 47.95,7.09 v47.95,8.56 | v39.14,8.84 37.54,7.24 U401.21 | v21.03,11.15 S010.P$1
  Bottom 0.152: v52.35,9.58 52.86,9.58 53.19,9.91 R010.1 | v47.95,8.56 47.68,8.28 40.79,8.28 40.23,8.84 v39.14,8.84 33.38,8.84 31.06,11.15 29.92,11.15 29.87,11.1 21.08,11.1 v21.03,11.15
USB_SOFTCONNECT  (via drill 0.33)
  Top 0.152: v33.96,8.26 33.02,9.2 U401.64
  Bottom 0.152: R051.2 50.15,8.92 Q050.1 49.78,8.59 49.17,7.98 40.66,7.98 40.39,8.26 v33.96,8.26
USBD+  (via drill 0.33)
  Top 0.152: v52.32,5.33 48.01,5.33 v47.6,5.74 | v42.7,5.99 42.7,5.92 41.45,5.92 U401.29
  Bottom 0.152: C030.1 53.21,4.57 53.21,3.3 R030.1 52.44,5.33 v52.32,5.33 | v42.7,5.99 42.95,5.74 v47.6,5.74
USBD-  (via drill 0.33)
  Top 0.152: v51.82,6.35 48.01,6.35 | v43.05,6.83 43.05,6.63 42.52,6.63 42.32,6.43 41.45,6.43 U401.30
  Bottom 0.152: R020.1 53.21,7.37 53.21,6.1 C020.1 52.94,6.35 v51.82,6.35 52.09,6.4 51.13,7.37 43.59,7.37 v43.05,6.83
VBUS
  Bottom 0.152: J001.1 55.91,7.4 55.88,7.37 55.63,7.62 55.63,8.13 55.12,8.64 R011.2 R010.2 53.85,9.91 53.85,10.79 52.45,12.19 52.45,14.48 51.31,15.62 51.31,20.57 51.05,20.83 49.53,20.83 49.53,19.18 48.64,19.18 48.53,19.07 | R304.2 C304.1 42.28,19.3 43.22,19.3 arc-90 U301.4 43.43,19.09 43.43,18.54 48.01,18.54 48.53,19.07 | 48.53,19.07 D302.1
VCC  (via drill 0.33)  (1 unrouted)
  Top 0.152: J701.4 54.36,14.46 v54.36,13.08 | C103.1 11.18,6.1 11.18,6.07 U2.3 9.83,6.1 | U2.2 C102.1 11.94,4.57 11.94,6.1 | 9.83,6.1 11.94,6.1 | C606.1 10.19,12.02 U601.6 8.38,10.5 8.38,6.86 | U601.1 14.19,12.02 C601.1 14.33,12.24 14.05,12.52 14.05,13.39 14.4,13.74 15.27,13.74 15.27,7.75 | U501.1 9.4,16.8 9.4,17.6 | U801.2 3.56,6.6 4.56,6.6 | 4.56,6.6 U801.4 | 8.38,6.86 8.38,6.1 9.83,6.1 | 9.4,17.6 9.4,18.8 v6.86,18.8 6.11,18.8 U402.8 6.04,17.27 4.34,17.27 4.34,16.99 3.66,16.31 v3.66,14.05 | 9.4,17.6 U501.16 U501.15 10.85,19.23 C501.1 9.4,19.42 9.4,19.3 | 29.53,19.3 U401.71 29.57,18.26 29.64,18.19 29.64,15.67 32.28,13.03 32.28,6.45 32.23,6.4 | 29.53,19.3 29.97,19.75 C471.1 29.97,20.57 | U401.28 43.04,5.41 C428.1 | U401.42 43.43,12.41 C442.1 | C442.1 43.43,12.19 | 4.56,6.6 v4.56,6.1 v4.57,6.1 5.59,6.1 6.35,6.86 8.38,6.86 | C802.1 1.27,11.54 v1.27,10.41 1.27,9.39 U801.13 | 15.27,7.75 14.12,6.6 13.18,6.6 13.18,6.63 13.03,6.78 11.99,6.78 11.99,6.15 11.94,6.1 | R425.1 25.91,0.89 24.64,0.89 R424.1 24.59,0.94 21.11,4.42 21.11,7.34 | 21.11,7.34 21.11,8.94 R453.1 21.08,9.02 23.44,11.38 23.44,11.63 C484.1 24.16,12.39 25.6,12.39 U401.84 | v55.55,10.79 53.34,8.59 53.34,2.54 J003.5 J003.4 47.57,3.23 v47.57,4.47 | 43.64,10.49 43.64,5.46 43.46,5.28 C428.1 | 43.64,10.49 43.64,11.99 43.48,12.14 C442.1 | v43.69,10.49 43.64,10.49 | v25.63,20.32 26.87,20.32 D401.1 | v29.21,19.58 29.46,19.33 29.53,19.3 | C454.1 37.41,19.81 37.41,19.66 38.02,19.05 38.02,18.34 U401.54 38.02,18.24 38.15,18.11 38.15,15.7 38.38,15.47 38.38,12.19 37.87,11.68 | 32.28,3.5 32.16,3.38 32.16,2.64 U401.10 | 32.28,3.5 33.02,3.5 U401.12 33.1,2.52 33.48,2.52 U401.13 33.53,1.52
  Top 0.152: 33.53,1.52 33.53,1.12 C413.1 | 35.31,1.57 35.26,1.52 33.53,1.52 | 35.31,1.57 35.41,1.68 35.41,2.39 35.51,2.49 U401.17 | 35.31,1.57 35.36,1.52 36.27,1.52 36.4,1.65 36.4,2.36 36.52,2.49 U401.19 36.52,2.59 36.52,10.34 37.87,11.68 | 32.23,6.4 25.7,6.4 U401.96 25.6,6.43 25.6,6.48 24.13,6.48 C496.1 24.11,6.55 24.11,7.21 v23.98,7.34 | 32.23,6.4 32.23,3.56 32.28,3.5 | 37.87,11.68 v38.99,10.57 | v44.53,4.57 43.69,5.41 C428.1 | v22.81,7.34 21.11,7.34 | v15.7,7.7 15.32,7.7 15.27,7.75
  Bottom 0.152: Q050.2 51.45,8.92 R051.1 51.45,10.67 49.15,10.67 | C205.1 48.23,13.21 U201.5 49.15,13.14 49.15,10.67 | v54.36,13.08 54.36,12.81 C701.1 54.36,11.99 v55.55,10.79 | C401.1 v6.86,18.8 | v4.57,6.1 4.57,6.6 1.27,6.6 v1.27,10.41 1.32,10.46 1.32,11.71 v3.66,14.05 | 49.15,10.67 48.97,10.49 v43.69,10.49 43.61,10.57 v38.99,10.57 | v25.63,20.32 26.36,19.58 v29.21,19.58 | v47.57,4.47 47.47,4.57 v44.53,4.57 | v23.98,7.34 v22.81,7.34 22.76,7.39 16,7.39 v15.7,7.7
VIN  (via drill 0.33)
  Top 0.152: v17.63,15.54 17.63,19.38 S201.3 | v44.83,12.75 45.06,12.52 45.06,9.17 44.7,8.81 v44.7,6.78 | v46.99,6.78 47.37,7.16 47.37,13.54 48.95,15.11 v48.95,16.56
  Bottom 0.152: D302.3 50.55,20.07 50.55,17.53 48.6,17.53 Q201.2 48.95,17.48 v48.95,16.56 | v17.63,15.54 18.03,15.14 31.6,15.14 33.43,13.31 44.27,13.31 v44.83,12.75 | v46.99,6.78 v44.7,6.78
VLIPO
  Bottom 0.152: J301.2 53.96,21.02 53.13,21.84 49.02,21.84 48.58,21.4 D302.2 48.53,20.08 48.51,20.07 47.24,20.07 C301.1 | C301.1 47.24,19.3 46.19,19.3 arc90 U301.3 | C301.1 47.36,19.3
XTAL1  (via drill 0.33)
  Top 0.152: v37.85,1.02 38.03,1.2 U401.22
  Bottom 0.152: C422.2 36.72,4.21 36.83,4.32 | 36.83,4.32 37.85,4.32 v37.85,1.02 | 36.83,4.32 36.78,4.37 Y422.3
XTAL2  (via drill 0.33)
  Top 0.152: U401.23 38.53,1.35 v38.86,1.02 38.61,1.27
  Bottom 0.152: v38.86,1.02 38.86,2.67 Y422.1 39.1,2.91 C423.2

### Text on the board
tPlace: RX | TX | GND | VCC | BAT | PPS
bPlace: IMUinator2368 | St Kwan's Home for | the Terminally ADD | a division of Kwan Systems | stkwans.blogspot.com | 1 May 2012 | RXD
Document: Released under the Creative Commons Attribution Share-Alike 3.0 License | http://creativecommons.org/licenses/by-sa/3.0 | Original design by C. Taylor and N. Seidle, Sparkfun Electronics http://www.sparkfun.com/products/10216 | Heavily modified by C. Jeppesen, St Kwan's Home for the Terminally ADD, stkwans.blogspot.com